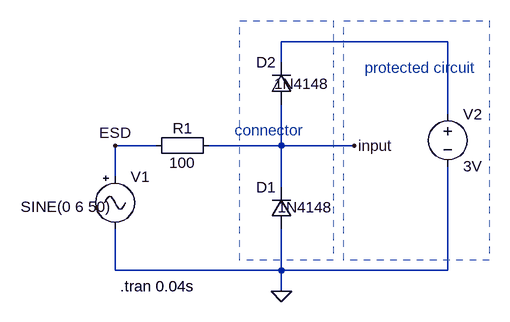
[diagram p0: schematic steering-diode-protection-circuit.asc]
steering-diode-protection-circuit.asc, the LTspice schematic file:
Version 4
SHEET 1 880 680
WIRE 704 64 448 64
WIRE 448 96 448 64
WIRE 704 176 704 64
WIRE 256 224 192 224
WIRE 448 224 448 160
WIRE 448 224 336 224
WIRE 560 224 448 224
WIRE 192 272 192 224
WIRE 448 288 448 224
WIRE 192 416 192 352
WIRE 448 416 448 352
WIRE 448 416 192 416
WIRE 704 416 704 256
WIRE 704 416 448 416
WIRE 448 448 448 416
FLAG 560 224 input
FLAG 448 448 0
FLAG 192 224 ESD
SYMBOL diode 464 352 R180
WINDOW 0 24 64 Left 2
WINDOW 3 -63 33 Left 2
SYMATTR InstName D1
SYMATTR Value 1N4148
SYMBOL Misc\\signal 192 256 R0
WINDOW 123 0 0 Left 2
WINDOW 3 -145 62 Left 2
SYMATTR Value SINE(0 6 50)
SYMATTR InstName V1
SYMBOL diode 464 160 R180
WINDOW 0 24 64 Left 2
WINDOW 3 -58 31 Left 2
SYMATTR InstName D2
SYMATTR Value 1N4148
SYMBOL voltage 704 160 R0
WINDOW 123 0 0 Left 0
WINDOW 39 0 0 Left 0
SYMATTR InstName V2
SYMATTR Value 3V
SYMBOL Misc\\EuropeanResistor 352 208 R90
WINDOW 0 5 56 VBottom 2
WINDOW 3 27 56 VTop 2
SYMATTR InstName R1
SYMATTR Value 100
TEXT 200 440 Left 2 !.tran 0.04s
TEXT 376 200 Left 2 ;connector
TEXT 576 104 Left 2 ;protected circuit
RECTANGLE Normal 528 400 384 32 2
RECTANGLE Normal 768 400 544 32 2

The netlist it stands for:
* steering-diode-protection-circuit.asc
D1 0 input 1N4148
V1 ESD 0 SINE(0 6 50)
D2 input N001 1N4148
V2 N001 0 3V
R1 input ESD 100
.model D D
.lib standard.dio
.tran 0.04s
* connector
* protected circuit
.backanno
.end